# Altium schematic sheet Display .SchDoc
size 297 x 209 mm; SheetNumber: 13; SheetTotal: 29
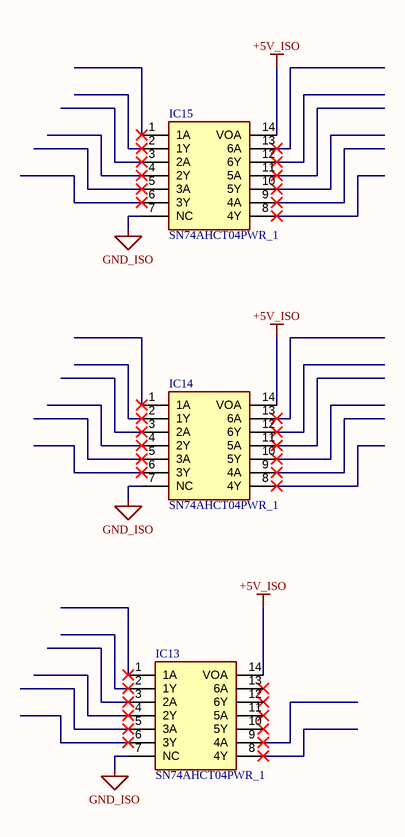
[diagram p0: Display .SchDoc]

## Parts
IC13  SN74AHCT04PWR_1  [SOP65P640X120-14N]
IC14  SN74AHCT04PWR_1  [SOP65P640X120-14N]
IC15  SN74AHCT04PWR_1  [SOP65P640X120-14N]

## Nets
+5V_ISO: IC13.14(VOA) IC14.14(VOA) IC15.14(VOA)
GND_ISO: IC13.7(NC) IC14.7(NC) IC15.7(NC)

Not connected (* = marked no-connect by the designer): IC13 1(1A)* 2(1Y)* 3(2A)* 4(2Y)* 5(3A)* 6(3Y)* 8(4Y)* 9(4A)* 10(5Y)* 11(5A)* 12(6Y)* 13(6A)*; IC14 1(1A)* 2(1Y)* 3(2A)* 4(2Y)* 5(3A)* 6(3Y)* 8(4Y)* 9(4A)* 10(5Y)* 11(5A)* 12(6Y)* 13(6A)*; IC15 1(1A)* 2(1Y)* 3(2A)* 4(2Y)* 5(3A)* 6(3Y)* 8(4Y)* 9(4A)* 10(5Y)* 11(5A)* 12(6Y)* 13(6A)*

## Notes on the sheet
- Drawn
- Name
- Date
- Drawing Title
- Checked
- Drawing No.
- Approved
- Size
- A4
- Ver.
- Rev.
- Sheet
- Of

## Library data of the parts
IC13-IC15 = SN74AHCT04PWR_1: Integrated Circuit; Manufacturer_Name: Texas Instruments; Datasheet Link: http://www.ti.com/lit/gpn/sn74ahct04; Height: 1.2mm; Manufacturer_Part_Number: SN74AHCT04PWR; Mouser Part Number: 595-SN74AHCT04PWR; Mouser Price/Stock: https://www.mouser.co.uk/ProductDetail/Texas-Instruments/SN74AHCT04PWR?qs=D5pVkbrsqqJ8K2Qvm77JIw%3D%3D; Arrow Part Number: SN74AHCT04PWR; Arrow Price/Stock: https://www.arrow.com/en/products/sn74ahct04pwr/texas-instruments?region=nac